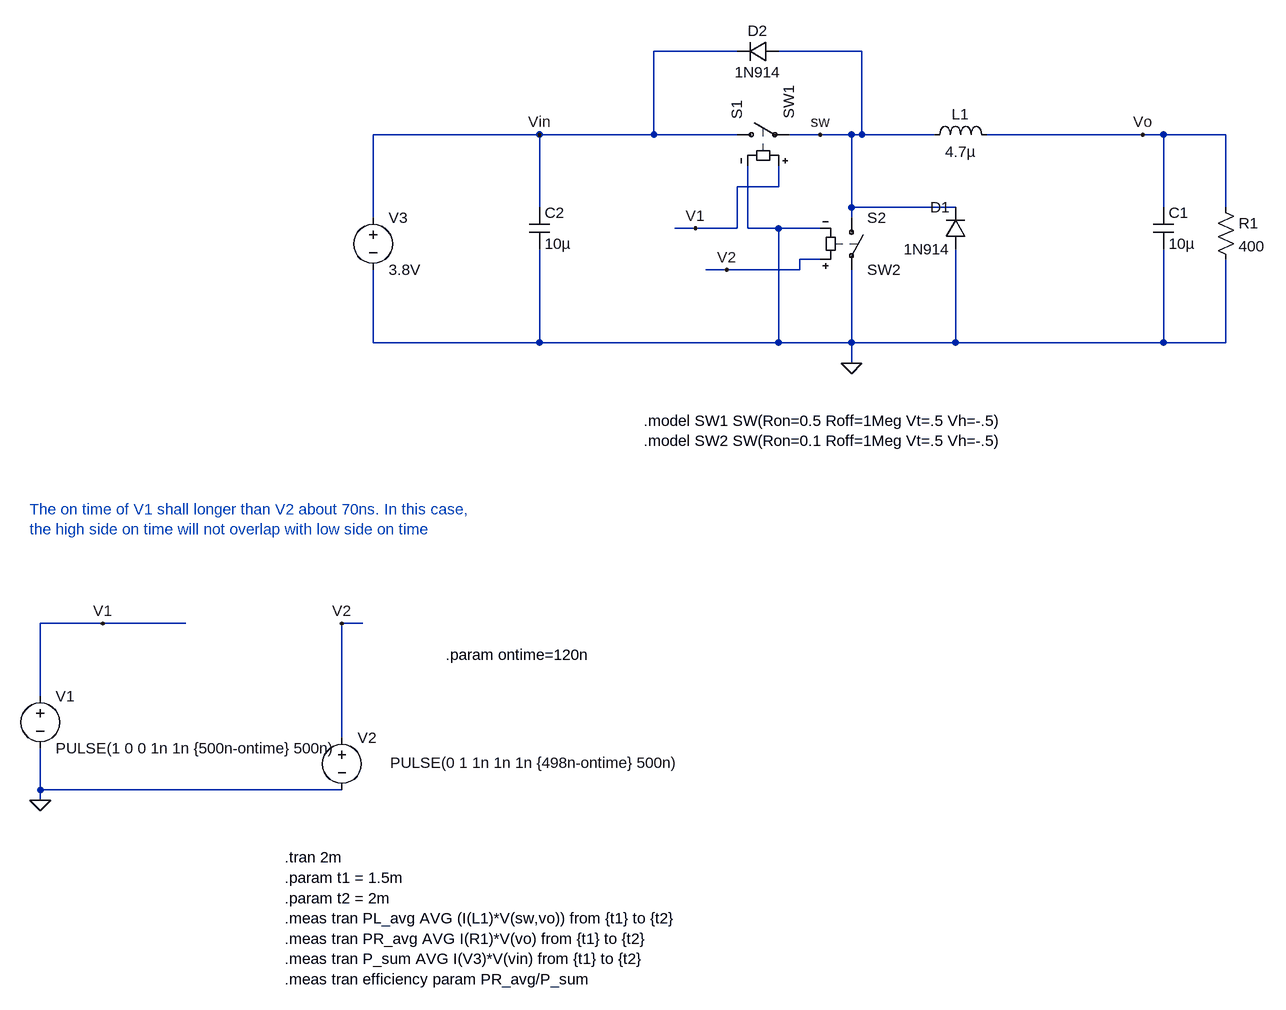
[diagram p0: schematic SMPS_Efficiency_V_switch.asc]
SMPS_Efficiency_V_switch.asc, the LTspice schematic file:
Version 4.1
SHEET 1 1944 1628
WIRE 1104 -736 976 -736
WIRE 1296 -736 1168 -736
WIRE 800 -608 544 -608
WIRE 976 -608 976 -736
WIRE 976 -608 800 -608
WIRE 1104 -608 976 -608
WIRE 1232 -608 1184 -608
WIRE 1280 -608 1232 -608
WIRE 1296 -608 1296 -736
WIRE 1296 -608 1280 -608
WIRE 1408 -608 1296 -608
WIRE 1728 -608 1488 -608
WIRE 1760 -608 1728 -608
WIRE 1856 -608 1760 -608
WIRE 1168 -528 1168 -560
WIRE 1168 -528 1104 -528
WIRE 800 -496 800 -608
WIRE 1280 -496 1280 -608
WIRE 1440 -496 1280 -496
WIRE 1760 -496 1760 -608
WIRE 1856 -496 1856 -608
WIRE 544 -480 544 -608
WIRE 1280 -480 1280 -496
WIRE 1040 -464 1008 -464
WIRE 1104 -464 1104 -528
WIRE 1104 -464 1040 -464
WIRE 1120 -464 1120 -560
WIRE 1168 -464 1120 -464
WIRE 1232 -464 1168 -464
WIRE 1232 -416 1200 -416
WIRE 1088 -400 1056 -400
WIRE 1200 -400 1200 -416
WIRE 1200 -400 1088 -400
WIRE 544 -288 544 -400
WIRE 800 -288 800 -432
WIRE 800 -288 544 -288
WIRE 1168 -288 1168 -464
WIRE 1168 -288 800 -288
WIRE 1280 -288 1280 -400
WIRE 1280 -288 1168 -288
WIRE 1440 -288 1440 -432
WIRE 1440 -288 1280 -288
WIRE 1760 -288 1760 -432
WIRE 1760 -288 1440 -288
WIRE 1856 -288 1856 -416
WIRE 1856 -288 1760 -288
WIRE 1280 -256 1280 -288
WIRE 128 144 32 144
WIRE 256 144 128 144
WIRE 528 144 496 144
WIRE 32 256 32 144
WIRE 496 320 496 144
WIRE 32 400 32 336
WIRE 496 400 32 400
WIRE 32 416 32 400
FLAG 32 416 0
FLAG 128 144 V1
FLAG 496 144 V2
FLAG 1280 -256 0
FLAG 1040 -464 V1
FLAG 1088 -400 V2
FLAG 1232 -608 sw
FLAG 800 -608 Vin
FLAG 1728 -608 Vo
SYMBOL voltage 32 240 R0
WINDOW 123 0 0 Left 0
WINDOW 39 0 0 Left 0
SYMATTR InstName V1
SYMATTR Value PULSE(1 0 0 1n 1n {500n-ontime} 500n)
SYMBOL voltage 496 304 R0
WINDOW 3 74 54 Left 2
WINDOW 123 0 0 Left 0
WINDOW 39 0 0 Left 0
SYMATTR Value PULSE(0 1 1n 1n 1n {498n-ontime} 500n)
SYMATTR InstName V2
SYMBOL voltage 544 -496 R0
WINDOW 123 0 0 Left 0
SYMATTR InstName V3
SYMATTR Value 3.8V
SYMATTR SpiceLine Rser=0.1
SYMBOL ind 1392 -592 R270
WINDOW 0 32 56 VTop 2
WINDOW 3 5 56 VBottom 2
SYMATTR InstName L1
SYMATTR Value 4.7µ
SYMATTR SpiceLine Ipk=0.6 Rser=0.050 Rpar=0 Cpar=0
SYMBOL res 1840 -512 R0
SYMATTR InstName R1
SYMATTR Value 400
SYMBOL cap 1744 -496 R0
SYMATTR InstName C1
SYMATTR Value 10µ
SYMATTR SpiceLine V=10 Irms=0 Rser=0 Lser=0 Rpar=1e9 Cpar=0 mfg="Murata" pn="GRM188R61A106KE69" type="X5R"
SYMBOL cap 784 -496 R0
SYMATTR InstName C2
SYMATTR Value 10µ
SYMATTR SpiceLine V=10 Irms=0 Rser=0 Lser=0 Rpar=1e9 Cpar=0 mfg="Murata" pn="GRM188R61A106MAAL" type="X5R"
SYMBOL sw 1088 -608 R270
SYMATTR InstName S1
SYMATTR Value SW1
SYMBOL sw 1280 -496 R0
SYMATTR InstName S2
SYMATTR Value SW2
SYMBOL diode 1456 -432 R180
WINDOW 0 24 64 Left 2
WINDOW 3 24 0 Left 2
SYMATTR InstName D1
SYMATTR Value 1N914
SYMBOL diode 1168 -752 R90
WINDOW 0 0 32 VBottom 2
WINDOW 3 32 32 VTop 2
SYMATTR InstName D2
SYMATTR Value 1N914
TEXT 408 504 Left 2 !.tran 2m\n.param t1 = 1.5m\n.param t2 = 2m\n.meas tran PL_avg AVG (I(L1)*V(sw,vo)) from {t1} to {t2}\n.meas tran PR_avg AVG I(R1)*V(vo) from {t1} to {t2}\n.meas tran P_sum AVG I(V3)*V(vin) from {t1} to {t2}\n.meas tran efficiency param PR_avg/P_sum
TEXT 16 -32 Left 2 ;The on time of V1 shall longer than V2 about 70ns. In this case,\nthe high side on time will not overlap with low side on time
TEXT 960 -168 Left 2 !.model SW1 SW(Ron=0.5 Roff=1Meg Vt=.5 Vh=-.5)\n.model SW2 SW(Ron=0.1 Roff=1Meg Vt=.5 Vh=-.5)
TEXT 656 192 Left 2 !.param ontime=120n

The netlist it stands for:
* SMPS_Efficiency_V_switch.asc
V1 V1 0 PULSE(1 0 0 1n 1n {500n-ontime} 500n)
V2 V2 0 PULSE(0 1 1n 1n 1n {498n-ontime} 500n)
V3 Vin 0 3.8V Rser=0.1
L1 sw Vo 4.7µ Ipk=0.6 Rser=0.050 Rpar=0 Cpar=0
R1 Vo 0 400
C1 Vo 0 10µ V=10 Irms=0 Rser=0 Lser=0 Rpar=1e9 Cpar=0 mfg="Murata" pn="GRM188R61A106KE69" type="X5R"
C2 Vin 0 10µ V=10 Irms=0 Rser=0 Lser=0 Rpar=1e9 Cpar=0 mfg="Murata" pn="GRM188R61A106MAAL" type="X5R"
S1 Vin sw V1 0 SW1
S2 sw 0 V2 0 SW2
D1 0 sw 1N914
D2 sw Vin 1N914
.model D D
.lib standard.dio
.tran 2m
.param t1 = 1.5m
.param t2 = 2m
.meas tran PL_avg AVG (I(L1)*V(sw,vo)) from {t1} to {t2}
.meas tran PR_avg AVG I(R1)*V(vo) from {t1} to {t2}
.meas tran P_sum AVG I(V3)*V(vin) from {t1} to {t2}
.meas tran efficiency param PR_avg/P_sum
* The on time of V1 shall longer than V2 about 70ns. In this case,
* the high side on time will not overlap with low side on time
.model SW1 SW(Ron=0.5 Roff=1Meg Vt=.5 Vh=-.5)
.model SW2 SW(Ron=0.1 Roff=1Meg Vt=.5 Vh=-.5)
.param ontime=120n
.backanno
.end